# EAGLE design OLEDHAT (EAGLE 9.5.0)
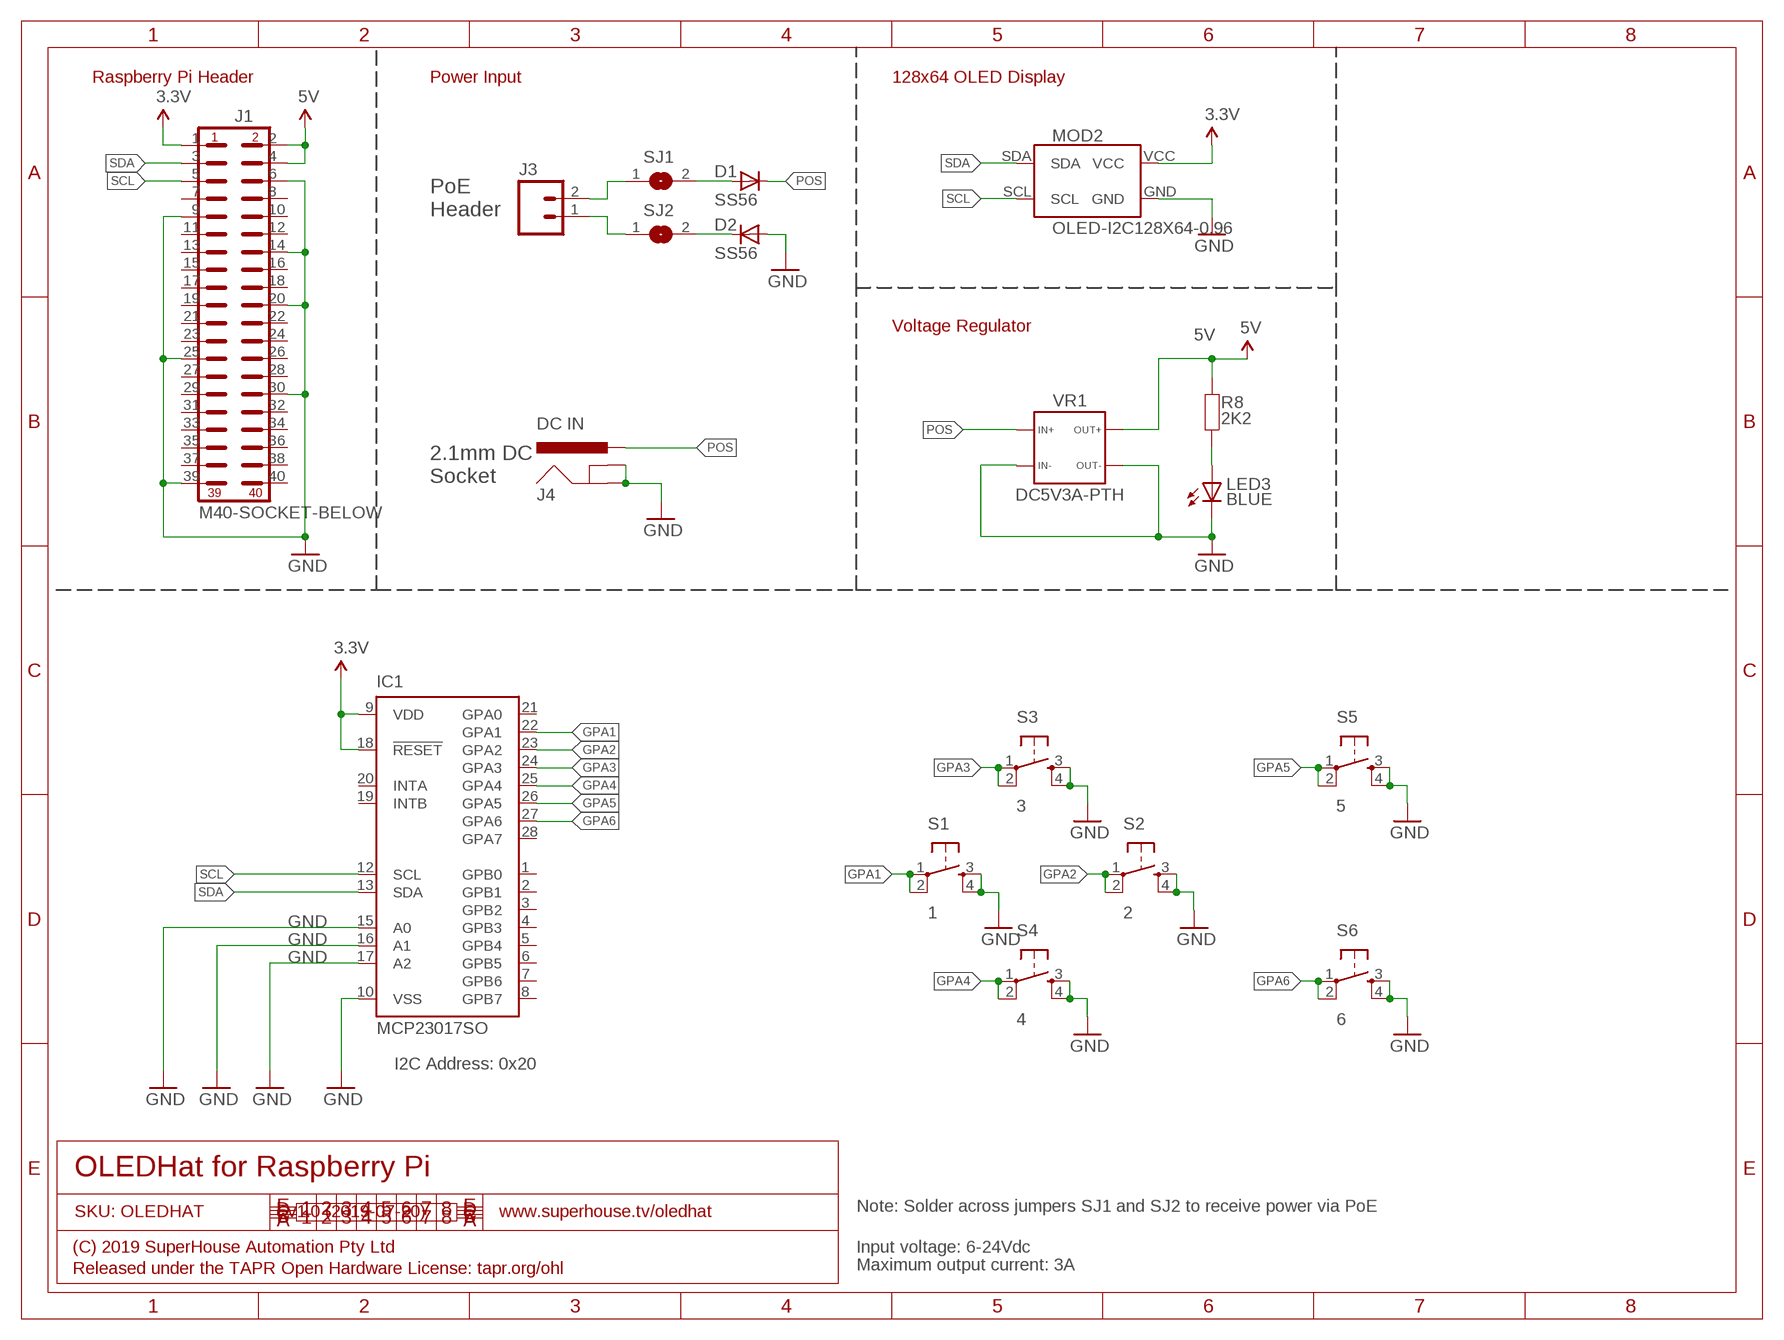
[diagram p0: schematic, sheet 1]

## Parts
D1  SS56  DIODESMA  [SMA-DIODE]
D2  SS56  DIODESMA  [SMA-DIODE]
IC1  MCP23017SO  [SO28W]
J1  M40-SOCKET-BELOW  [2X20-S-BELOW]
J3  M02-SOCKET-BELOW  [1X02-S-BELOW]
J4  DC IN  POWER_JACK-SLOTS  [POWER_JACK_SLOTS]
LED3  BLUE  LED0603  [LED-0603]
MOD2  OLED-I2C128X64-0.96  [OLED-128X64-0.96]
R8  2K2  RESISTOR0603  [R0603]
S1  1  TAC_SWITCH4.5  [TACTILE-PTH-4.5MM]
S2  2  TAC_SWITCH4.5  [TACTILE-PTH-4.5MM]
S3  3  TAC_SWITCH4.5  [TACTILE-PTH-4.5MM]
S4  4  TAC_SWITCH4.5  [TACTILE-PTH-4.5MM]
S5  5  TAC_SWITCH4.5  [TACTILE-PTH-4.5MM]
S6  6  TAC_SWITCH4.5  [TACTILE-PTH-4.5MM]
SJ1  SJN  [SJ]
SJ2  SJN  [SJ]
VR1  DC5V3A-PTH  [DC5V3A-PTH]

## Nets
3.3V: IC1.9(VDD) IC1.18(!RESET) J1.1 MOD2.VCC
5V: J1.2 J1.4 R8.1 VR1.3A VR1.3B
GND: D2.A IC1.10(VSS) IC1.15(A0) IC1.16(A1) IC1.17(A2) J1.6 J1.9 J1.14 J1.20 J1.25 J1.30 J1.39 J4.GND J4.GNDBREAK LED3.C MOD2.GND S1.3 S1.4 S2.3 S2.4 S3.3 S3.4 S4.3 S4.4 S5.3 S5.4 S6.3 S6.4 VR1.1A VR1.1B VR1.4A VR1.4B
GPA1: IC1.22(GPA1) S1.1 S1.2
GPA2: IC1.23(GPA2) S2.1 S2.2
GPA3: IC1.24(GPA3) S3.1 S3.2
GPA4: IC1.25(GPA4) S4.1 S4.2
GPA5: IC1.26(GPA5) S5.1 S5.2
GPA6: IC1.27(GPA6) S6.1 S6.2
N$1: J3.1 SJ2.1
N$2: J3.2 SJ1.1
N$24: D1.A SJ1.2
N$25: D2.C SJ2.2
N$203: LED3.A R8.2
POS: D1.C J4.PWR VR1.2A VR1.2B
SCL: IC1.12(SCL) J1.5 MOD2.SCL
SDA: IC1.13(SDA) J1.3 MOD2.SDA
Unconnected: IC1.1(GPB0) IC1.2(GPB1) IC1.3(GPB2) IC1.4(GPB3) IC1.5(GPB4) IC1.6(GPB5) IC1.7(GPB6) IC1.8(GPB7) IC1.19(INTB) IC1.20(INTA) IC1.21(GPA0) IC1.28(GPA7) J1.7 J1.8 J1.10 J1.11 J1.12 J1.13 J1.15 J1.16 J1.17 J1.18 J1.19 J1.21 J1.22 J1.23 J1.24 J1.26 J1.27 J1.28 J1.29 J1.31 J1.32 J1.33 J1.34 J1.35 J1.36 J1.37 J1.38 J1.40

## Notes on the sheet
- Raspberry Pi Header | Power Input | 128x64 OLED Display
- PoE
  Header
- Voltage Regulator
- 2.1mm DC
  Socket
- I2C Address: 0x20
- OLEDHat for Raspberry Pi
- Note: Solder across jumpers SJ1 and SJ2 to receive power via PoE
- SKU: OLEDHAT | v1.0 (2019-07-20) | www.superhouse.tv/oledhat
- (C) 2019 SuperHouse Automation Pty Ltd | Input voltage: 6-24Vdc
- Released under the TAPR Open Hardware License: tapr.org/ohl | Maximum output current: 3A

## Library data of the parts
D1 D2 = SuperHouse-DiscreteSemi:DIODE: Diode Standard reverse protection diodes and small signal diodes. SMA package can handle up to about 1A. SOD-323 can handle about 200mA.
IC1 = SuperHouse-ICs:MCP23017: http://ww1.microchip.com/downloads/en/DeviceDoc/21952a.pdf Source: http://ww1.microchip.com/downloads/en/DeviceDoc/21952a.pdf
J1 = SuperHouse-Connectors:M40: 40-way header
J3 = SuperHouse-Connectors:M02: 2-way header Standard 1x2 header, and screw terminal variations
J4 = SuperHouse-Connectors:POWER_JACK: Power Jack This is the standard 5.5mm barrel jack for power. The PTH is the most common, proven, reliable, footprint. All others are experimental. The Slot footprint only works if the mill layer is transmitted to the PCB fab house so be warned. Spark Fun Electronics SKU : PRT-00119. Mating wall wart : TOL-00298 (and others)
LED3 = SuperHouse-LEDs:LED: LEDs Standard schematic elements and footprints for 5mm, 3mm, 1206, and 0603 sized LEDs. 5mm - Spark Fun Electronics SKU : COM-00529 (and others)
MOD2 = SuperHouse-Displays:OLED-I2C: OLED module with SSD1306 I2C driver
R8 = SuperHouse-DiscreteSemi:RESISTOR: Resistor Standard resistors.
S1-S6 = SuperHouse-Switches:TAC_SWITCH: Momentary Switch Tactile switch, normally-open.
SJ1 SJ2 = freetronics-jon:SJ: SMD solder JUMPER
VR1 = SuperHouse-Regulators:DC5V3A: 5V 3A voltage regulator module from AliExpress

## Board
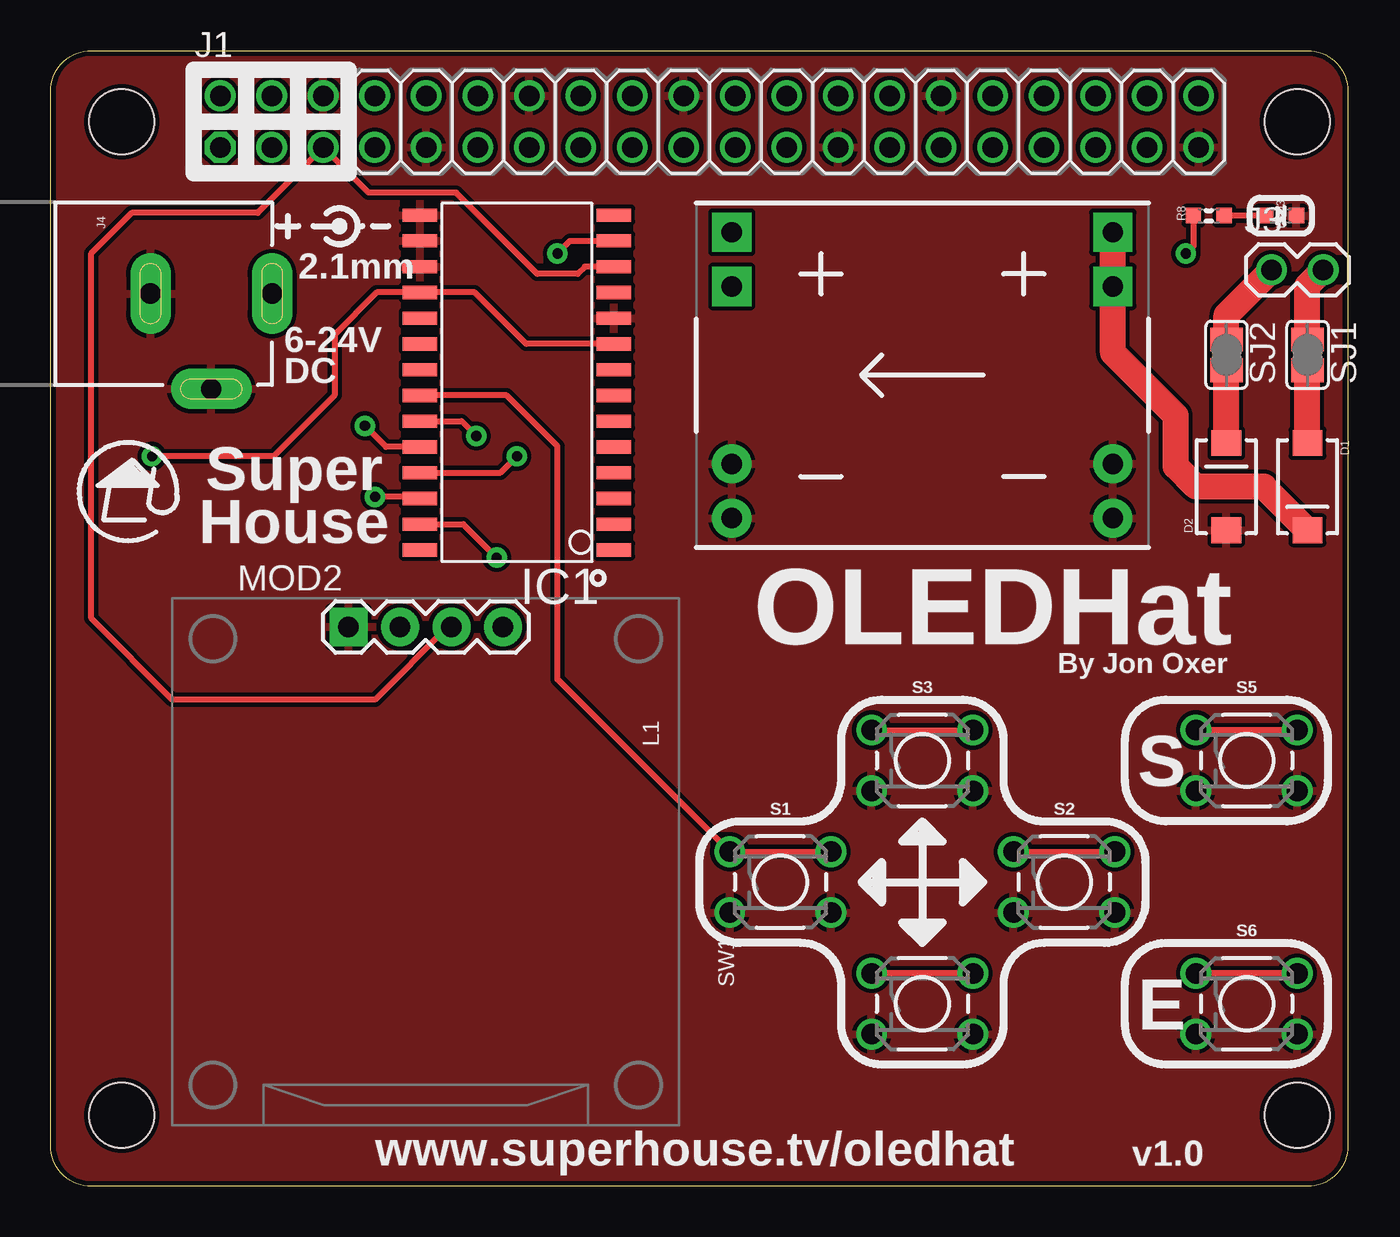
[diagram p1: board, top side]
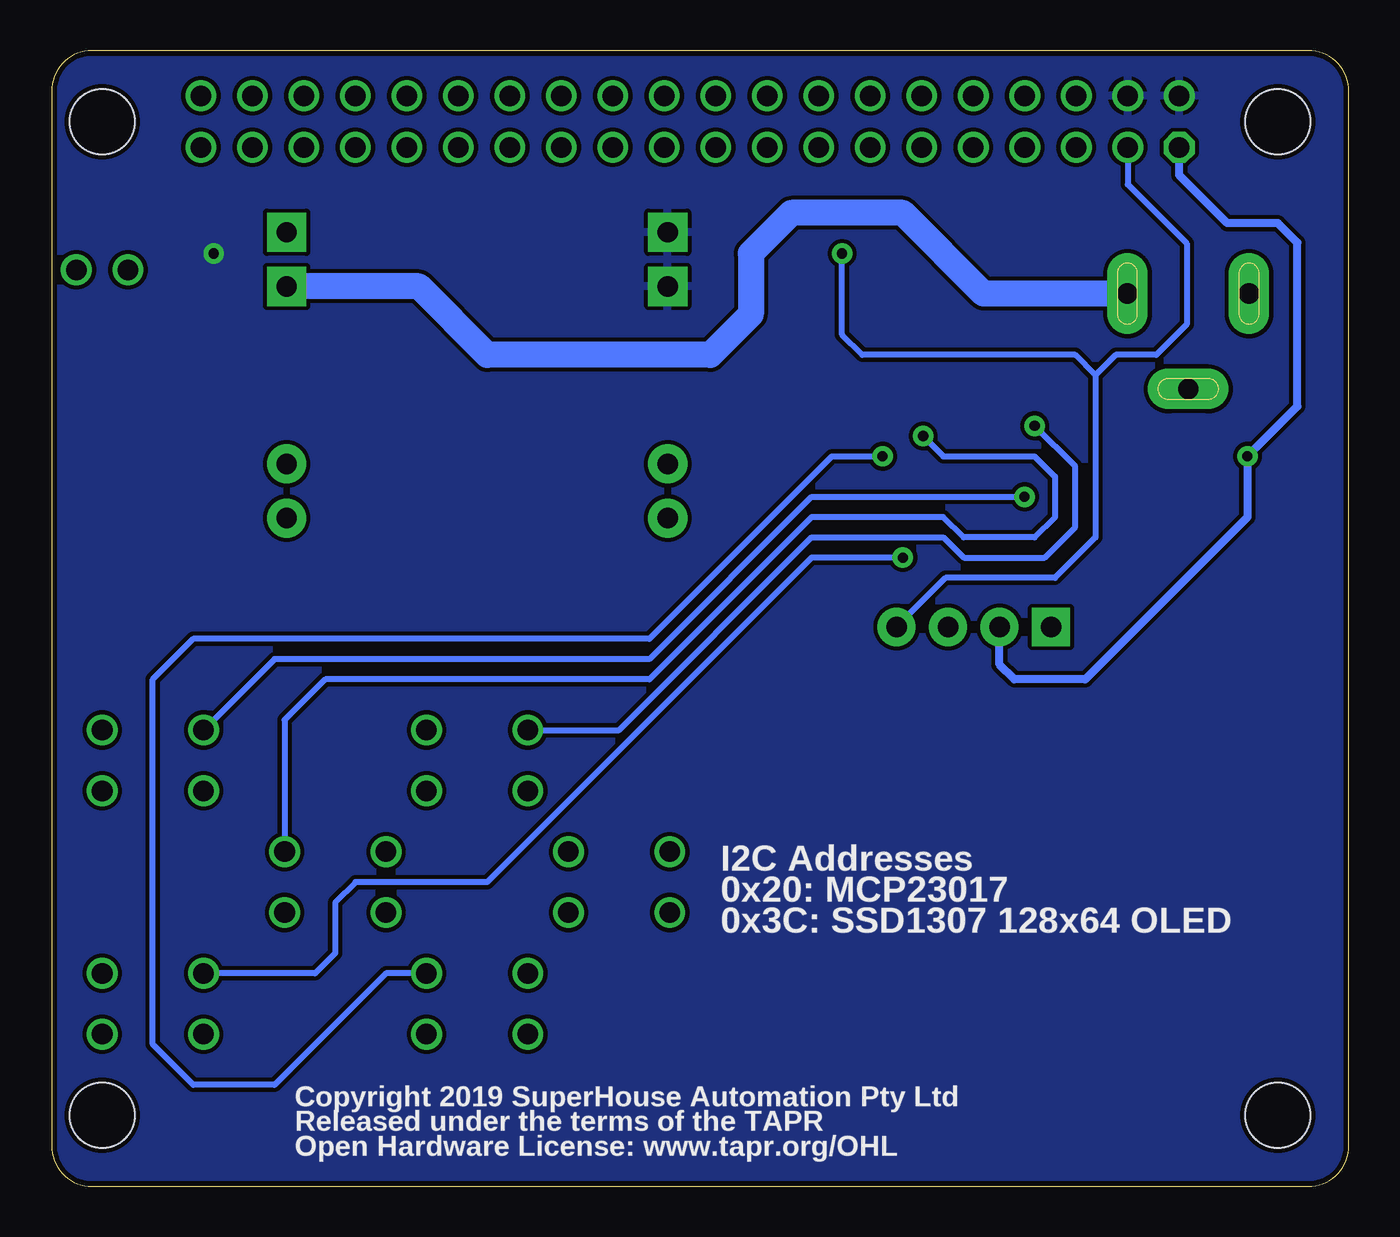
[diagram p2: board, bottom side, seen from below]

Size 64 x 56 mm. Coordinates in mm from the lower left corner, seen from the top.
Outline: 0,54 arc-90 2,56 62,56 arc-90 64,54 64,2 arc-90 62,0 2,0 arc-90 0,2 0,54
Copper layers (1*16): Top 0.035mm / dielectric 1.5mm / Bottom 0.035mm
Design rules "default *": minimum track width 8mil, minimum drill 0.4mm, track to track 8mil, track to pad 8mil, pad to pad 8mil, via to via 8mil, smd to smd 8mil, copper to edge 10mil, drill to drill 8mil, minimum pad ring 8mil, minimum via ring 10mil, stop-mask expansion 3mil, vias tented up to drill 25mil, thermal gap 8mil
Holes 3.2 mm at 3.5,52.5 61.5,52.5 61.5,3.5 3.5,3.5

### Footprints (pad centres in the part's own frame; a part is rotated, then mirrored left to right if it is on the bottom)
SMA-DIODE = smd 1.27 x 1.47: A -2.15,0; C 2.15,0
SO28W = smd 0.65 x 1.7: 1 -7.62,-4.78; 2 -6.35,-4.78; 3 -5.08,-4.78; 4 -3.81,-4.78; 5 -2.54,-4.78; 6 -1.27,-4.78; 7 0,-4.78; 8 1.27,-4.78; 9 2.54,-4.78; 10 3.81,-4.78; 11 5.08,-4.78; 12 6.35,-4.78; 13 7.62,-4.78; 14 8.89,-4.78; 15 8.89,4.78; 16 7.62,4.78; 17 6.35,4.78; 18 5.08,4.78; 19 3.81,4.78; 20 2.54,4.78; 21 1.27,4.78; 22 0,4.78; 23 -1.27,4.78; 24 -2.54,4.78; 25 -3.81,4.78; 26 -5.08,4.78; 27 -6.35,4.78; 28 -7.62,4.78
2X20-S-BELOW = drill 1.016 octagon: 1 0,0 | drill 1.016: 2 0,2.54; 3 2.54,0; 4 2.54,2.54; 5 5.08,0; 6 5.08,2.54; 7 7.62,0; 8 7.62,2.54; 9 10.16,0; 10 10.16,2.54; 11 12.7,0; 12 12.7,2.54; 13 15.24,0; 14 15.24,2.54; 15 17.78,0; 16 17.78,2.54; 17 20.32,0; 18 20.32,2.54; 19 22.86,0; 20 22.86,2.54; 21 25.4,0; 22 25.4,2.54; 23 27.94,0; 24 27.94,2.54; 25 30.48,0; 26 30.48,2.54; 27 33.02,0; 28 33.02,2.54; 29 35.56,0; 30 35.56,2.54; 31 38.1,0; 32 38.1,2.54; 33 40.64,0; 34 40.64,2.54; 35 43.18,0; 36 43.18,2.54; 37 45.72,0; 38 45.72,2.54; 39 48.26,0; 40 48.26,2.54
1X02-S-BELOW = drill 1.016: 1 0,0; 2 2.54,0
POWER_JACK_SLOTS = drill 1 pad 2 long: GND 0,7.7; GNDBREAK 4.7,10.7; PWR 0,13.7
LED-0603 = smd 0.762 x 0.762: A -0.762,0; C 0.762,0
OLED-128X64-0.96 = drill 1.016 pad 1.88 square: GND -3.81,10.58 | drill 1.016 pad 1.88: SCL 1.27,10.58; SDA 3.81,10.58; VCC -1.27,10.58
R0603 = smd 0.762 x 0.762: 1 -0.762,0; 2 0.762,0
TACTILE-PTH-4.5MM = drill 1.016: 1 -2.5,1.5; 2 2.5,1.5; 3 -2.5,-1.5; 4 2.5,-1.5
SJ = smd 1.168 x 1.6: 1 -0.762,0; 2 0.762,0
DC5V3A-PTH = drill 1 pad 1.93: 1A -9.4,7.05; 1B -9.4,4.375; 4A 9.4,7.05; 4B 9.4,4.375 | drill 1 pad 1.93 square: 2A -9.4,-4.375; 2B -9.4,-7.05; 3A 9.4,-4.375; 3B 9.4,-7.05

### Placement (x,y rotation side)
D1  62,34.5 270 top
D2  58,34.5 90 top
IC1  23,39 90 top
J1  8.37,51.23 0 top
J3  60.23,45.19 0 top
J4  -2.78,44.02 270 top
LED3  60.69,47.86 0 top
MOD2  18.5,17 0 top
R8  57.13,47.86 0 top
S1  36,15 0 top
S2  50,15 0 top
S3  43,21 0 top
S4  43,9 0 top
S5  59,21 0 top
S6  59,9 0 top
SJ1  62,41 270 top
SJ2  58,41 270 top
VR1  43,40 180 top

### Tracks (layer width: path | path; a pad name or v marks a point on that pad's centre or on a via)
3.3V  (via drill 0.5)
  Top 0.305: IC1.9 23.46,41.54 20.92,44.08 IC1.18 16.08,44.08 14,42 14,39 11,36 v5,36
  Bottom 0.406: MOD2.VCC 17.23,25.73 16.5,25 13,25 5,33 v5,36 2.54,38.46 2.54,46.54 3.5,47.5 6,47.5 8.37,49.87 J1.1
5V  (via drill 0.5)
  Top 0.305: R8.1 56.37,46.37 v56,46
  pour Bottom: 2,56.32 61.94,56.32 arc-90 63.94,54.32 63.94,2 arc-90 61.94,0 2,0 arc-90 0,2 0,54.32 arc-90
GND
  pour Top: 2,56 64,56 64,0 2,0 arc-90 0,2 0,54 arc-90
GPA1
  Top 0.305: S1.2 S1.1 25,25 25,36.5 22.5,39 IC1.22
GPA2  (via drill 0.5)
  Top 0.305: S2.1 S2.2 | IC1.23 20.27,37.73 v21,37
  Bottom 0.305: v21,37 20,36 15.5,36 14.5,35 14.5,33 15.5,32 19,32 20,33 26.5,33 34.5,25 50.5,25 52.5,23 S2.2
GPA3  (via drill 0.5)
  Top 0.305: S3.1 S3.2 | IC1.24 16.54,36.46 v15.5,37.5
  Bottom 0.305: S3.1 36,22.5 26.5,32 20,32 19,31 15,31 13.5,32.5 13.5,35.5 v15.5,37.5
GPA4  (via drill 0.5)
  Top 0.305: S4.2 S4.1 | IC1.25 22.19,35.19 v23,36
  Bottom 0.305: v23,36 25.5,36 34.5,27 57,27 59,25 59,7 57,5 53,5 47.5,10.5 S4.2
GPA5  (via drill 0.5)
  Top 0.254: IC1.26 18.14,34
  Top 0.305: S5.2 S5.1 | 18.14,34 v16,34
  Bottom 0.305: v16,34 26.5,34 34.5,26 53,26 S5.1
GPA6  (via drill 0.5)
  Top 0.305: S6.2 S6.1 | IC1.27 20.35,32.65 v22,31
  Bottom 0.305: v22,31 26.5,31 42.5,15 49,15 50,14 50,11.5 51,10.5 S6.1
N$1
  Top 1.27: SJ2.1 58,42.96 J3.1
N$2
  Top 1.27: J3.2 62,44.42 SJ1.1
N$24
  Top 1.27: D1.A SJ1.2
N$25
  Top 1.27: D2.C SJ2.2
N$203
  Top 0.305: LED3.A R8.2
POS
  Top 1.27: VR1.2B VR1.2A 52.4,41.1 55.5,38 55.5,35.5 56.5,34.5 59.85,34.5 D1.C
  Bottom 1.27: J4.PWR 18.02,44.02 22,48 27.5,48 29.5,46 29.5,43 31.5,41 42.5,41 45.88,44.38 VR1.2A
SCL
  Top 0.305: IC1.12 26.35,45.35 26,45 24,45 20,49 15.68,49 J1.5 10.22,48 4,48 2,46 2,28 6,24 16,24 19.58,27.58 MOD2.SCL
SDA  (via drill 0.5)
  Top 0.305: v25,46 25.62,46.62 IC1.13
  Bottom 0.305: J1.3 10.91,49.41 8,46.5 8,42.5 9.5,41 11.5,41 12.5,40 | MOD2.SDA 19.89,30 14.5,30 12.5,32 12.5,40 | 12.5,40 13.5,41 24,41 25,42 v25,46

### Text on the board
tPlace: 2.1mm | 6-24V / DC | Super / House | OLEDHat | By Jon Oxer | S | E | www.superhouse.tv/oledhat | v1.0
bPlace: I2C Addresses / 0x20: MCP23017 / 0x3C: SSD1307 128x64 OLED | Copyright 2019 SuperHouse Automation Pty Ltd / Released under the terms of the TAPR / Open Hardware License: www.tapr.org/OHL
tNames: L1 | SW1